# EAGLE design thermostat-2layer-v1 (EAGLE 7.7.0)
DESIGNER: K. GOBA
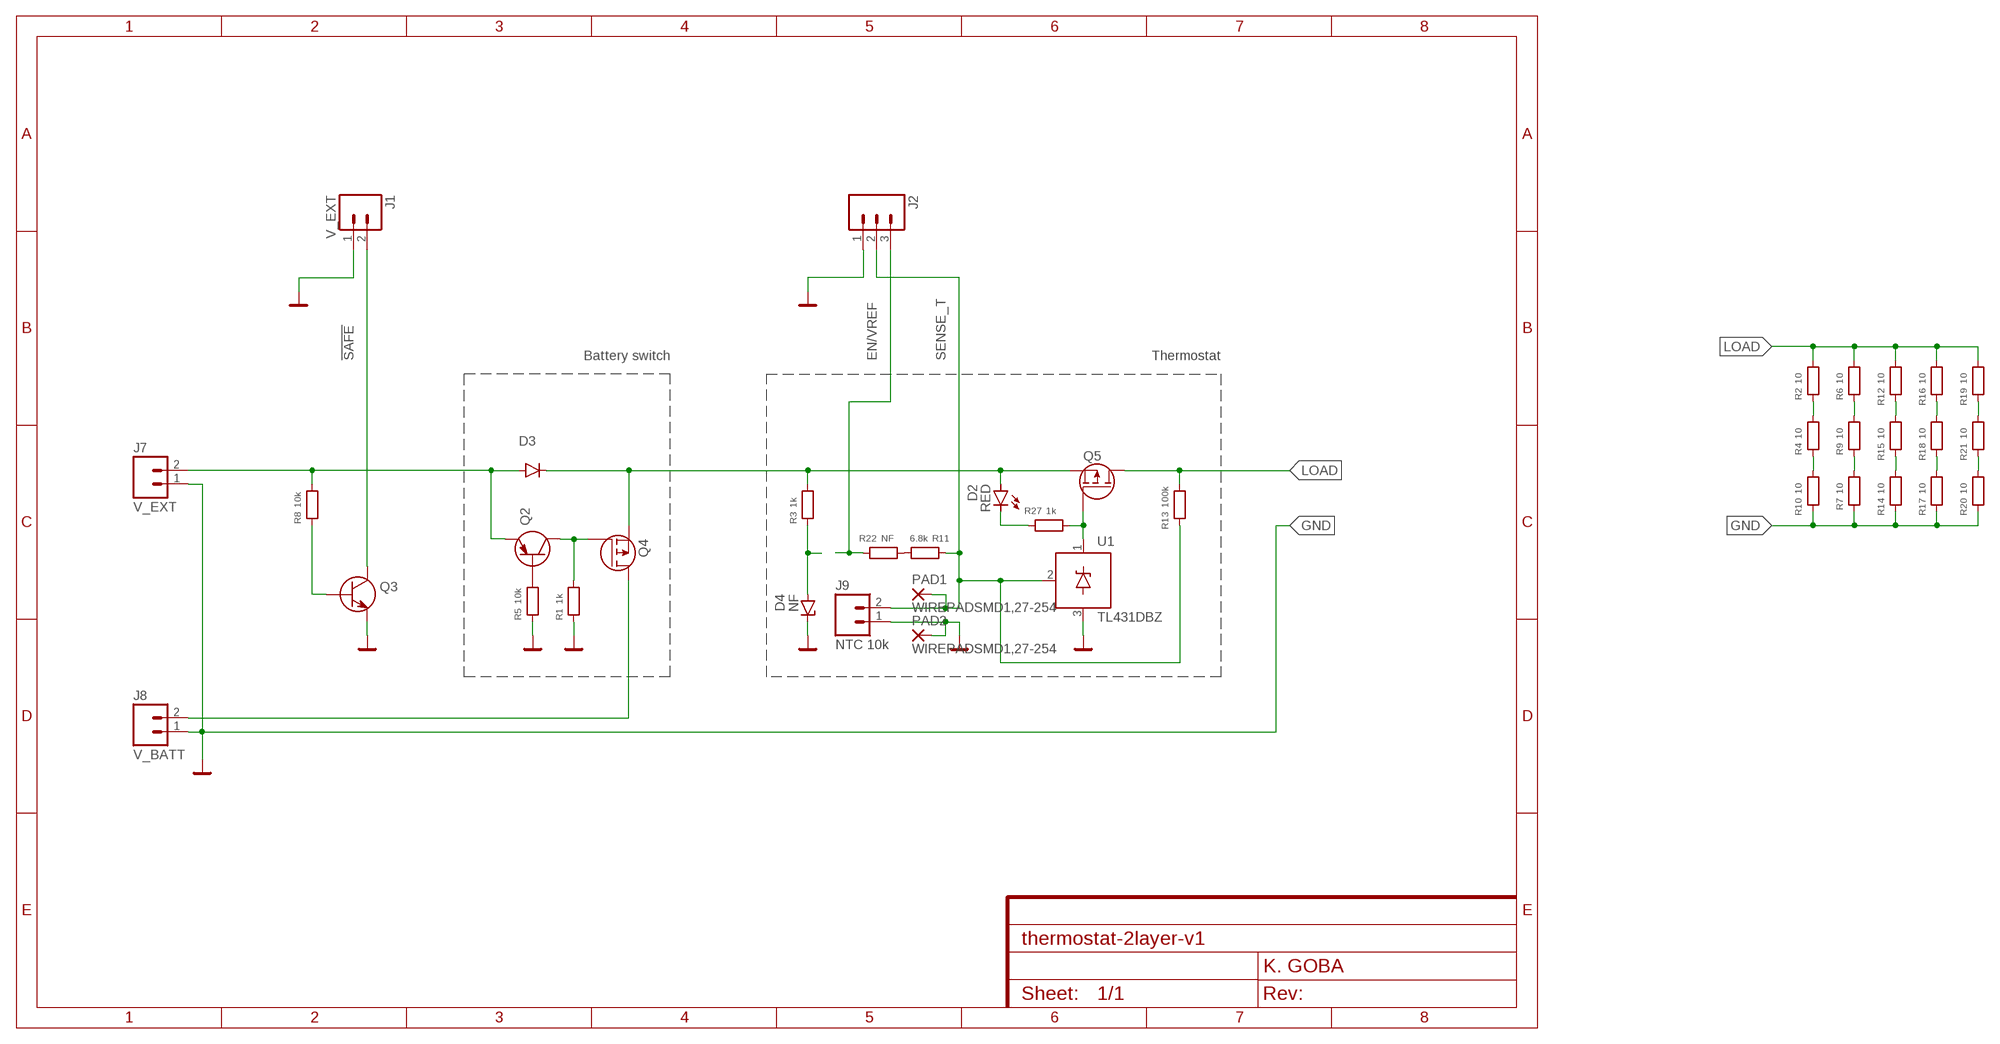
[diagram p0: schematic, sheet 1]

## Parts
D2  RED  LED0805  [R0805]
D3  DIODE-SMA-ALT  [D-SMA-ALT]
D4  NF  DIODE-ZENER-SOD80  [SOD80]
J1  V_EXT  M2-2MM-JST  [JST-2-PTH-VERT]
J2  M3-CT-V  [JST-3-PTH-VERT]
J7  V_EXT  M2-2MM-JST  [JST-2-PTH-VERT]
J8  V_BATT  M2-2MM-JST  [JST-2-PTH-VERT]
J9  NTC 10k  M2-2MM-JST  [JST-2-PTH-VERT]
PAD1  WIREPADSMD1,27-254  [SMD1,27-2,54]
PAD2  WIREPADSMD1,27-254  [SMD1,27-2,54]
Q2  BJT-PNPSMD  [SOT23-3]
Q3  BJT-NPN-SOT23-3  [SOT23-3]
Q4  MOSFET-P-SOT23-3  [SOT23-3]
Q5  MOSFET-P-SOT23-3  [SOT23-3]
R1  1k  RESISTOR-0603  [R0603]
R2  10  RESISTOR-1206  [R1206]
R3  1k  RESISTOR-0603  [R0603]
R4  10  RESISTOR-1206  [R1206]
R5  10k  RESISTOR-0603  [R0603]
R6  10  RESISTOR-1206  [R1206]
R7  10  RESISTOR-1206  [R1206]
R8  10k  RESISTOR-0603  [R0603]
R9  10  RESISTOR-1206  [R1206]
R10  10  RESISTOR-1206  [R1206]
R11  6.8k  RESISTOR-0603  [R0603]
R12  10  RESISTOR-1206  [R1206]
R13  100k  RESISTOR-0603  [R0603]
R14  10  RESISTOR-1206  [R1206]
R15  10  RESISTOR-1206  [R1206]
R16  10  RESISTOR-1206  [R1206]
R17  10  RESISTOR-1206  [R1206]
R18  10  RESISTOR-1206  [R1206]
R19  10  RESISTOR-1206  [R1206]
R20  10  RESISTOR-1206  [R1206]
R21  10  RESISTOR-1206  [R1206]
R22  NF  RESISTOR-0603  [R0603]
R27  1k  RESISTOR-0603  [R0603]
U1  TL431DBZ  [SOT23-3]

## Nets
!SAFE: J1.2 Q3.3(C)
EN/VREF: J2.3 R22.1
GND: D4.C J1.1 J2.1 J7.1 J8.1 J9.1 PAD2.1(P) Q3.2(E) R1.1 R5.1 R7.1 R10.1 R14.1 R17.1 R20.1 U1.3(A)
LOAD: Q5.3(D) R2.2 R6.2 R12.2 R13.2 R16.2 R19.2
N$5: D2.2(C) R27.1
N$8: D4.A R3.1
N$9: R2.1 R4.2
N$12: R4.1 R10.2
N$13: D2.1(A) D3.C Q4.2(S) Q5.2(S) R3.2
N$14: Q2.3(C) Q4.1(G) R1.2
N$15: J8.2 Q4.3(D)
N$16: Q2.1(B) R5.2
N$17: D3.A J7.2 Q2.2(E) R8.2
N$19: R6.1 R9.2
N$20: R7.2 R9.1
N$21: Q3.1(B) R8.1
N$22: R12.1 R15.2
N$23: Q5.1(G) R27.2 U1.1(C)
N$24: R14.2 R15.1
N$25: R16.1 R18.2
N$26: R17.2 R18.1
N$27: R19.1 R21.2
N$28: R20.2 R21.1
N$29: R11.2 R22.2
SENSE_T: J2.2 J9.2 PAD1.1(P) R11.1 R13.1 U1.2(R)

## Notes on the sheet
- Battery switch | Thermostat

## Library data of the parts
D2 = kg-generic:LED: LEDs Standard schematic elements and footprints for 5mm, 3mm, 1206, and 0603 sized LEDs. 5mm - Spark Fun Electronics SKU : COM-00529 (and others)
D3 = kg-generic:DIODE: Diode These are standard reverse protection diodes and small signal diodes. SMA package can handle up to about 1A. SOD-323 can handle about 200mA. What the SOD-323 package when ordering, there are some mfgs out there that are 5-pin packages.
D4 = kg-generic:DIODE-ZENER: Zener Diode Production Part - 8199 3.4V Zener Voltage
J1 J7-J9 = kg-amp-ct:M2: 2 pin male header/connector
J2 = kg-amp-ct:M3: 3 pin male header/connector
PAD1 PAD2 = wirepad:WIREPAD: Wire PAD connect wire on PCB
Q2 = kg-generic:BJT-PNP: Generic PNP BJT Double check pinouts against datasheets- not all devices are the same! MMBT3906 - 40V 200mA SOT-23 (TRANS-08052) MMBT4403 - 40V 600mA SOT-23 (TRANS-09245)
Q3 = kg-generic:BJT-NPN: Generic NPN BJT BC547 (TO-92 45V 100mA) (1.Collector 2.Base 3.Emitter) 2N3904 (TO-92 40V 200mA) (1.Emitter 2.Base 3.Collector) 2N2222A (TO-92 40V 600mA) (1.Collector 2.Base 3.Emitter)
Q4 Q5 = kg-generic:MOSFET-P: Generic P-MOSFET IRF7406 SO8 30V 5.8A 45mOhm IRLML6401 SOT23-3 12V 4.3A 50mOhm IRLML6402 SOT23-3 20V 3.7A 65mOhm
R1-R22 R27 = kg-generic:RESISTOR: Generic resistor
U1 = kg-supply:TL431: Precision Programmable Reference

## Board
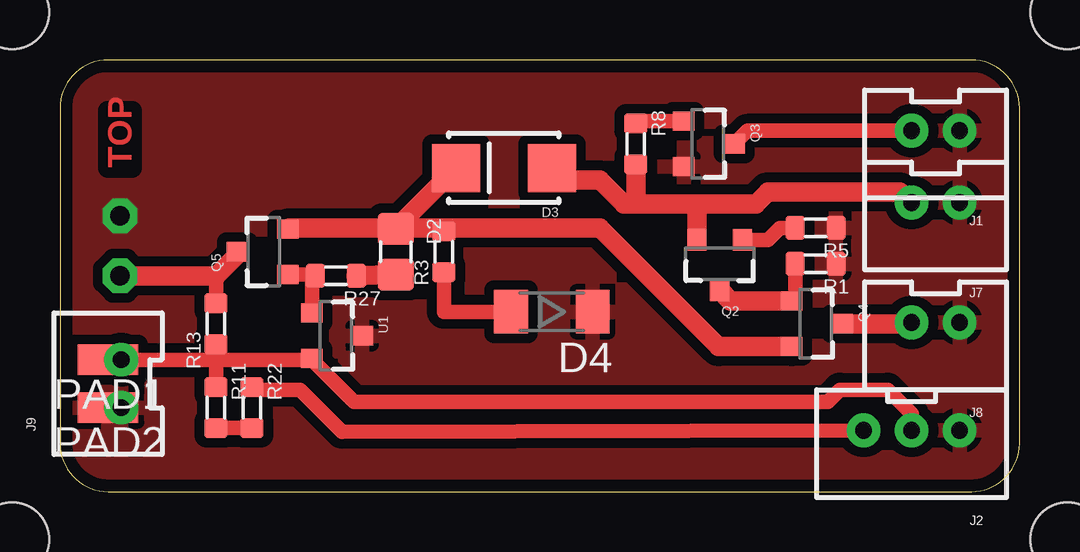
[diagram p1: board, top side]
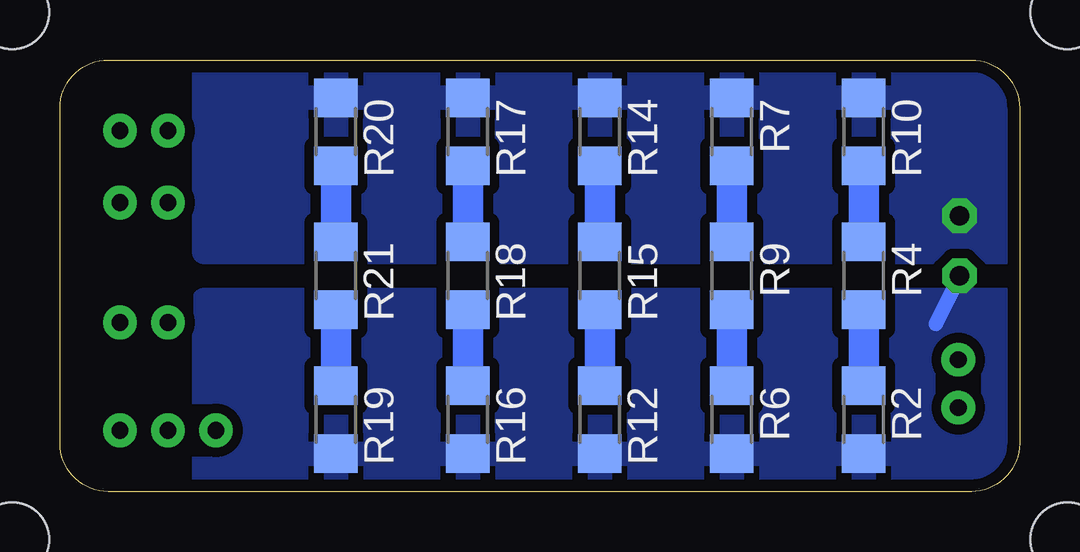
[diagram p2: board, bottom side, seen from below]

Size 40 x 18 mm. Coordinates in mm from the lower left corner, seen from the top.
Outline: 40,2 40,16 arc90 38,18 2,18 arc90 0,16 0,2 arc90 2,0 38,0 arc90 40,2
Copper layers (1*16): Top 0.035mm / dielectric 1.5mm / Bottom 0.035mm
Design rules "ShenZhen2U_2layer_EagleRules *": minimum track width 7mil, minimum drill 12mil, track to track 7mil, track to pad 7mil, pad to pad 7mil, via to via 7mil, smd to smd 0mil, copper to edge 20mil, drill to drill 10mil, minimum pad ring 14mil, minimum via ring 6mil, stop-mask expansion 2mil, vias tented up to drill 25mil, thermal gap 10mil
Holes 3.1 mm at 42,20 -2,-2 42,-2 -2,20

### Footprints (pad centres in the part's own frame; a part is rotated, then mirrored left to right if it is on the bottom)
R0805 = smd 1.3 x 1.5: 1 -0.95,0; 2 0.95,0
D-SMA-ALT = smd 2 x 2: A -2,0; C 2,0
SOD80 = smd 1.4 x 1.8: A 1.7,0; C -1.7,0
JST-2-PTH-VERT = drill 0.7: 1 -1,-0.55; 2 1,-0.55
JST-3-PTH-VERT = drill 0.7: 1 -2,-0.55; 2 0,-0.55; 3 2,-0.55
SMD1,27-2,54 = smd 1.27 x 2.54: 1 0,0
SOT23-3 = smd 0.8 x 0.9: 1 -0.95,-1; 2 0.95,-1; 3 0,1.1
R0603 = smd 0.8 x 0.95: 1 -0.85,0; 2 0.85,0
R1206 = smd 1.6 x 1.803: 1 -1.422,0; 2 1.422,0

### Placement (x,y rotation side)
D2  14,10 270 top
D3  18.5,13.5 180 top
D4  20.5,7.5 180 top
J1  36.5,14.5 180 top
J2  35.5,2 180 top
J7  36.5,11.5 180 top
J8  36.5,6.5 180 top
J9  2,4.5 90 top
PAD1  2,5.5 90 top
PAD2  2,3.5 90 top
Q2  27.5,9.5 180 top
Q3  27,14.5 270 top
Q4  31.5,7 270 top
Q5  8.5,10 90 top
R1  31.5,9.5 180 top
R2  6.5,3 270 bottom
R3  16,10 90 top
R4  6.5,9 270 bottom
R5  31.5,11 180 top
R6  12,3 270 bottom
R7  12,15 270 bottom
R8  24,14.5 270 top
R9  12,9 270 bottom
R10  6.5,15 270 bottom
R11  6.5,3.5 270 top
R12  17.5,3 270 bottom
R13  6.5,7 90 top
R14  17.5,15 270 bottom
R15  17.5,9 270 bottom
R16  23,3 270 bottom
R17  23,15 270 bottom
R18  23,9 270 bottom
R19  28.5,3 270 bottom
R20  28.5,15 270 bottom
R21  28.5,9 270 bottom
R22  8,3.5 270 top
R27  11.5,9 180 top
U1  11.5,6.5 270 top

### Tracks (layer width: path | path; a pad name or v marks a point on that pad's centre or on a via)
!SAFE
  Top 0.61: J1.2 28.65,15.05 Q3.3
EN/VREF
  Top 0.61: J2.3 11.75,2.5 10,4.25 8.15,4.25 R22.1
GND  (via drill 0.8 pad 1.42)
  other vias: 2.5,11.5
  pour Top (isolate 0.406): 0,0 40,0 40,18 0,18
  pour Bottom (isolate 0.406): -1,18 34,18 34,10 -1,10
LOAD  (via drill 0.8 pad 1.42)
  Top 0.61: R13.2 6.5,9
  Top 0.813: Q5.3 7.5,10 6.5,9 v2.5,9
  Bottom 0.61: v2.5,9 3.5,7
  pour Bottom (isolate 0.406): -1,8 34,8 34,0 -1,0
N$5
  Top 0.813: D2.2 13.6,9.05 R27.1
N$8
  Top 0.61: R3.1 16,7.5 D4.A
N$9
  Bottom 1.27: R2.1 R4.2
N$12
  Bottom 1.27: R4.1 R10.2
N$13
  Top 0.61: R3.2 16,11
  Top 0.813: 14,11 16,11 22.5,11 27.45,6.05 Q4.2 | D3.C 14,11 | 14.1,11.15 14,11 | 14,11 9.55,11 Q5.2 | D2.1 14,11
N$14
  Top 0.61: R1.2 30.65,8.1 Q4.1
  Top 0.813: Q4.1 27.95,7.95 Q2.3
N$15
  Top 0.813: J8.2 35.5,7 Q4.3
N$16
  Top 0.61: Q2.1 29.5,10.5 30,11 R5.2
N$17
  Top 0.813: J7.2 35.45,12.05 35,12.5 29.5,12.5 29,12 26.5,12 | 26.5,12 24,12 | 24,12 23.5,12 22.5,13 21,13 D3.A | Q2.2 26.55,11.95 26.5,12 | R8.2 24,12
N$19
  Bottom 1.27: R6.1 R9.2
N$20
  Bottom 1.27: R9.1 R7.2
N$21
  Top 0.61: 26.1,15.45 Q3.1 24.1,15.45 R8.1
N$22
  Bottom 1.27: R12.1 R15.2
N$23
  Top 0.61: Q5.1 10.6,9.05 R27.2 10.5,8.85 U1.1
N$24
  Bottom 1.27: R15.1 R14.2
N$25
  Bottom 1.27: R16.1 R18.2
N$26
  Bottom 1.27: R18.1 R17.2
N$27
  Bottom 1.27: R19.1 R21.2
N$28
  Bottom 1.27: R21.1 R20.2
N$29
  Top 0.61: R11.2 R22.2
SENSE_T
  Top 0.61: J2.2 35.5,3.25 34.5,4.25 32.5,4.25 32,3.75 12.25,3.75 10.5,5.5 U1.2 10.45,5.5 6.5,5.5 | PAD1.1 J9.2 6.5,5.5 | R13.1 6.5,5.5 | R11.1 6.5,5.5

### Text on the board
Top: TOP